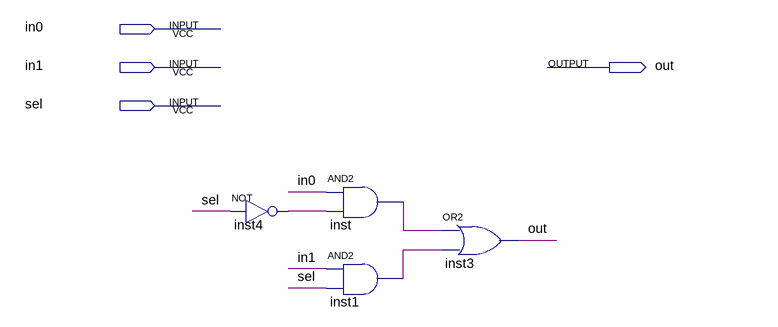
[diagram p0: schematic sheet]
// Quartus schematic MUX_2x1_1bit.bdf as structural Verilog: 4 symbols, 4 pins
module MUX_2x1_1bit (
  input  in0,
  input  in1,
  input  sel,
  output out
);

  wire inst1_out, inst4_out, inst_out;

  not inst4 (inst4_out, sel);
  and inst (inst_out, in0, inst4_out);
  and inst1 (inst1_out, in1, sel);
  or inst3 (out, inst_out, inst1_out);
endmodule
